# Altium schematic sheet AD9361 Baseband and Control.SchDoc
size A4
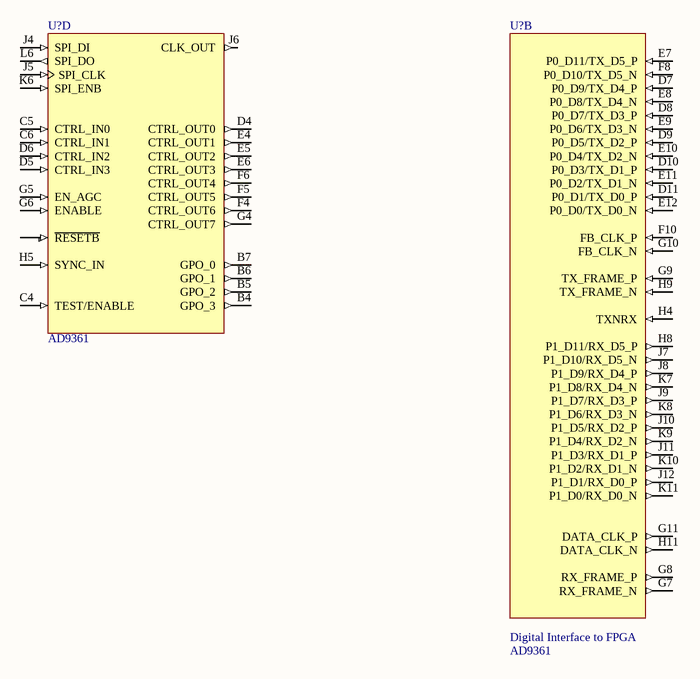
[diagram p0: AD9361 Baseband and Control.SchDoc]

## Parts
(Parts that share a designator on the sheet are numbered #1, #2 ... from top to bottom, then left to right.)
U?#1  AD9361  [BGA144C80P12X12_1000X1000X170]  (part D of 4)
U?#2  AD9361  [BGA144C80P12X12_1000X1000X170]  (part B of 4)

## Nets

Not connected (* = marked no-connect by the designer): U?#1 ?1(~{RESETB}) B4(GPO_3) B5(GPO_2) B6(GPO_1) B7(GPO_0) C4(TEST/ENABLE) C5(CTRL_IN0) C6(CTRL_IN1) D4(CTRL_OUT0) D5(CTRL_IN3) D6(CTRL_IN2) E4(CTRL_OUT1) E5(CTRL_OUT2) E6(CTRL_OUT3) F4(CTRL_OUT6) F5(CTRL_OUT5) F6(CTRL_OUT4) G4(CTRL_OUT7) G5(EN_AGC) G6(ENABLE) H5(SYNC_IN) J4(SPI_DI) J5(SPI_CLK) J6(CLK_OUT) K6(SPI_ENB) L6(SPI_DO); U?#2 D7(P0_D9/TX_D4_P) D8(P0_D7/TX_D3_P) D9(P0_D5/TX_D2_P) D10(P0_D3/TX_D1_P) D11(P0_D1/TX_D0_P) E7(P0_D11/TX_D5_P) E8(P0_D8/TX_D4_N) E9(P0_D6/TX_D3_N) E10(P0_D4/TX_D2_N) E11(P0_D2/TX_D1_N) E12(P0_D0/TX_D0_N) F8(P0_D10/TX_D5_N) F10(FB_CLK_P) G7(RX_FRAME_N) G8(RX_FRAME_P) G9(TX_FRAME_P) G10(FB_CLK_N) G11(DATA_CLK_P) H4(TXNRX) H8(P1_D11/RX_D5_P) H9(TX_FRAME_N) H11(DATA_CLK_N) J7(P1_D10/RX_D5_N) J8(P1_D9/RX_D4_P) J9(P1_D7/RX_D3_P) J10(P1_D5/RX_D2_P) J11(P1_D3/RX_D1_P) J12(P1_D1/RX_D0_P) K7(P1_D8/RX_D4_N) K8(P1_D6/RX_D3_N) K9(P1_D4/RX_D2_N) K10(P1_D2/RX_D1_N) K11(P1_D0/RX_D0_N)

## Notes on the sheet
- Title
- Size:
- Date:
- A3
- Drawn by:
- Time:
- Revision:
- Sheet
- of
- File:
- (in symbol AD9361, part B) Digital Interface to FPGA

## Library data of the parts
U?#1 U?#2 = AD9361: RF Agile Transceiver 2Tx x 2Rx